# Altium project PCB_REMOTE_LORA.PrjPcb
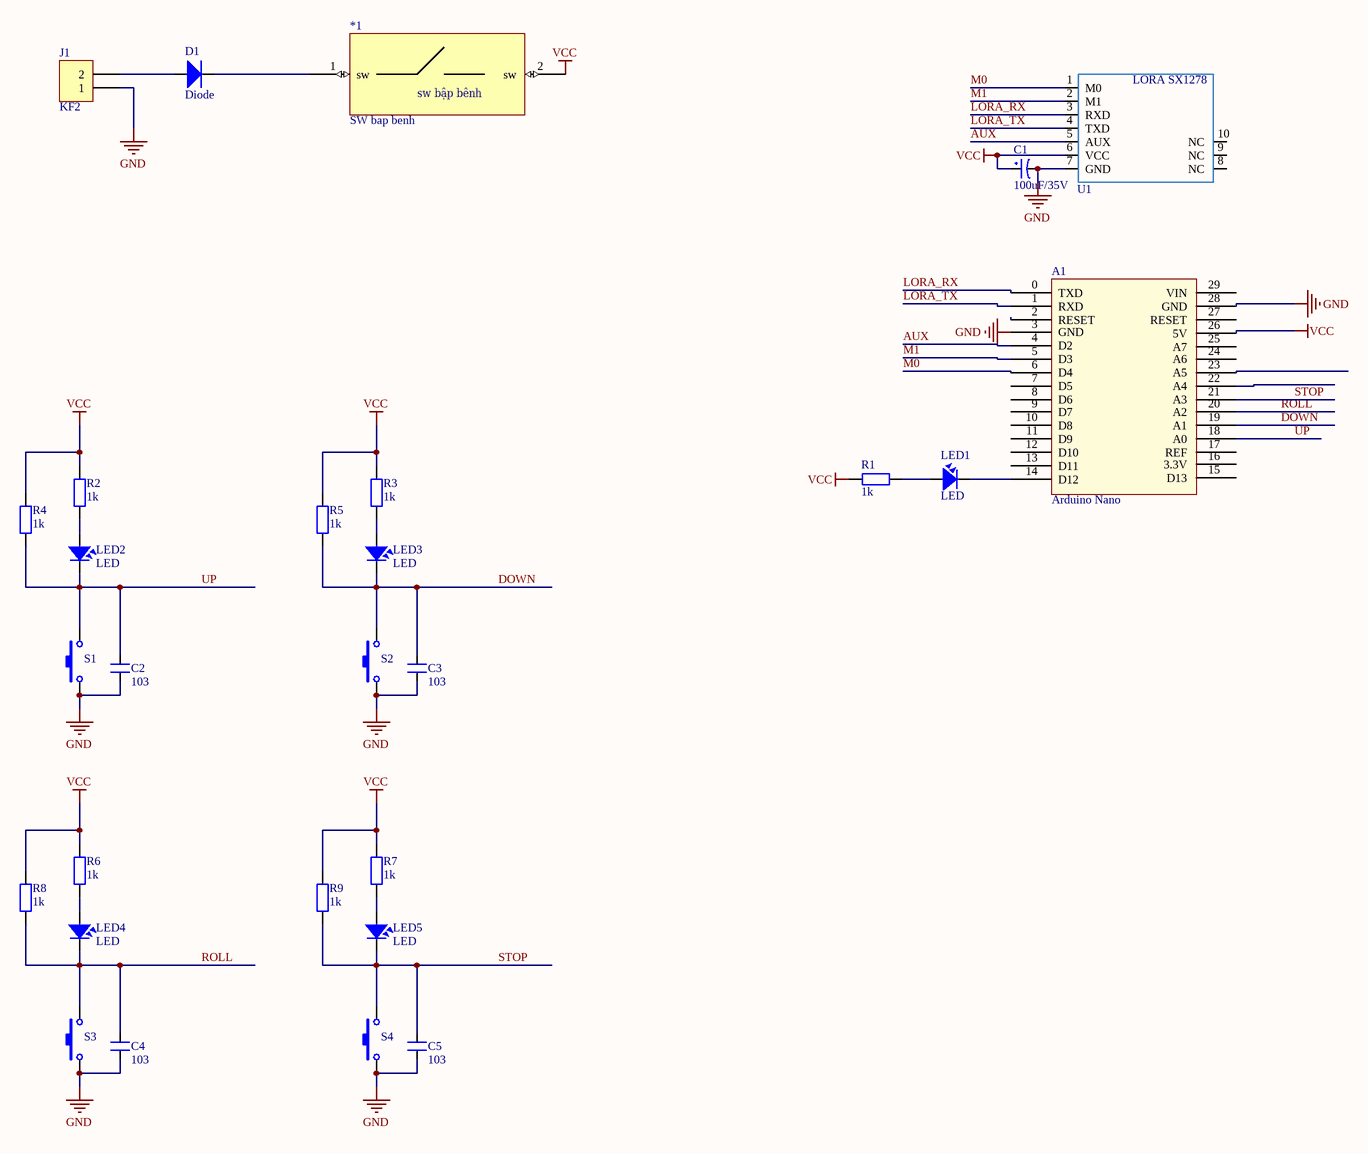
[diagram p0: RemoteLora.SchDoc]
1 sheet, 28 parts. Net scope: global (net labels, ports and power ports of the same name join across sheets).
Board file: RemoteLora.PcbDoc

## Sheet RemoteLora.SchDoc
size A0

### Parts
*1  SW bap benh  [SW bapbenh]
A1  Arduino Nano  [Arduino Nano]
C1  100uF/35V  [CP1.5/3.4]
C2  103  [SM-0805]
C3  103  [SM-0805]
C4  103  [SM-0805]
C5  103  [SM-0805]
D1  Diode  [D0.5A]
J1  KF2  [KF2-3.5]
LED1  LED  [LED-5-BLUE]
LED2  LED  [LED-5-BLUE]
LED3  LED  [LED-5-BLUE]
LED4  LED  [LED-5-BLUE]
LED5  LED  [LED-5-BLUE]
R1  1k  [RES-1/4W]
R2  1k  [RES-1/4W]
R3  1k  [RES-1/4W]
R4  1k  [RES-1/4W]
R5  1k  [RES-1/4W]
R6  1k  [RES-1/4W]
R7  1k  [RES-1/4W]
R8  1k  [RES-1/4W]
R9  1k  [RES-1/4W]
S1  SW  [BUTTON  ROUND]  (value not drawn)
S2  SW  [BUTTON  ROUND]  (value not drawn)
S3  SW  [BUTTON  ROUND]  (value not drawn)
S4  SW  [BUTTON  ROUND]  (value not drawn)
U1  Lora SX1278 UART  [Lora_uart_sx1278]  (value not drawn)

### Nets
GND: A1.3(GND) A1.28(GND) C1.2 C2.1 C3.1 C4.1 C5.1 J1.1 S1.1 S2.1 S3.1 S4.1 U1.7(GND)
VCC: *1.2(sw) A1.26(5V) C1.1 R1.1 R2.2 R3.2 R4.2 R5.2 R6.2 R7.2 R8.2 R9.2 U1.6(VCC)
AUX: A1.4(D2) U1.5(AUX)
DOWN: A1.19(A1) C3.2 LED3.2 R5.1 S2.2
LORA_RX: A1.0(TXD) U1.3(RXD)
LORA_TX: A1.1(RXD) U1.4(TXD)
M0: A1.6(D4) U1.1(M0)
M1: A1.5(D3) U1.2(M1)
ROLL: A1.20(A2) C4.2 LED4.2 R8.1 S3.2
STOP: A1.21(A3) C5.2 LED5.2 R9.1 S4.2
UP: A1.18(A0) C2.2 LED2.2 R4.1 S1.2
Net*1_1: *1.1(sw) D1.2
NetA1_14: A1.14(D12) LED1.2
NetD1_1: D1.1 J1.2
NetLED1_1: LED1.1 R1.2
NetLED2_1: LED2.1 R2.1
NetLED3_1: LED3.1 R3.1
NetLED4_1: LED4.1 R6.1
NetLED5_1: LED5.1 R7.1

Not connected (* = marked no-connect by the designer): A1 2(RESET) 7(D5) 8(D6) 9(D7) 10(D8) 11(D9) 12(D10) 13(D11) 15(D13) 16(3.3V) 17(REF) 22(A4) 23(A5) 24(A6) 25(A7) 27(RESET) 29(VIN); U1 8(NC) 9(NC) 10(NC)

### Notes on the sheet
- (in symbol Lora SX1278 UART) LORA SX1278
- (in symbol SW bap benh) sw bập bênh

### Library data of the parts
C1 = CP3: Cap 100uF/35V - 470uF/16V; Value: 100uF/35V/50V; Description 1: 1000uF/6,3V - 470uF/16V - 330uF - 25V; Description 2: 220uF/35V - 100uF/50V - 63V - 4,7uF/200V; Description 3: 22uF => 33uF100V - 3,3uF => 4,7uF/250V; Description 4: 2,2uF =>3,3uF/350 - 2,2uF/400V - 1uF/450V
C2-C5 = CM: Cap SMD; Value: 103
J1 = KF2: Manufacturer: Würth Elektronik eiSos GmbH; partNo: 691103110002; ComponentLink1 Description: Manufacturer; ComponentLink2 Description: Datasheet; NoPins: 2; Created Date: 29 October 2013; ComponentLink1URL: http://www.we-online.com; ComponentLink2URL: http://katalog.we-online.de/em/datasheet/6911031100xx.pdf; Created by: Karrer Zheng
R1-R9 = R: Resistor R1/4W
S1-S4 = SW-Button: Switch-Button; Published: 24-Mar-1999; LatestRevisionDate: 17-Jul-2002; LatestRevisionNote: Re-released for DXP Platform.; PackageReference: SPST-2; Publisher: Altium Limited